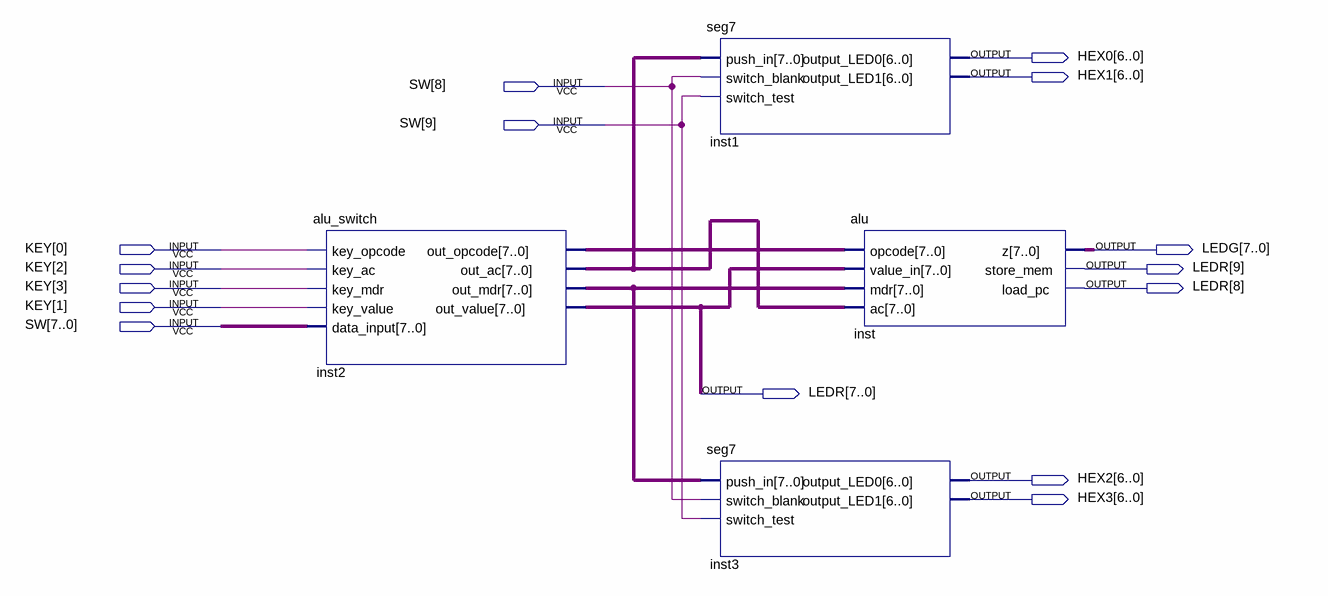
[diagram p0: schematic sheet]
// Quartus schematic alu_sim_tb.bdf as structural Verilog: 4 symbols, 15 pins
module alu_sim_tb (
  input  [9:0] SW,
  input  [3:0] KEY,
  output [6:0] HEX0,
  output [6:0] HEX1,
  output [7:0] LEDG,
  output [9:0] LEDR,
  output [6:0] HEX2,
  output [6:0] HEX3
);

  wire [7:0] inst2_out_ac, inst2_out_mdr, inst2_out_opcode;

  alu_switch inst2 (
    .key_opcode(KEY[0]), .key_ac(KEY[2]), .key_mdr(KEY[3]), .key_value(KEY[1]), .data_input(SW[7:0]),
    .out_opcode(inst2_out_opcode), .out_ac(inst2_out_ac), .out_mdr(inst2_out_mdr), .out_value(LEDR[7:0]));
  seg7 inst1 (
    .push_in(inst2_out_ac), .switch_blank(SW[8]), .switch_test(SW[9]), .output_LED0(HEX0), .output_LED1(HEX1));
  seg7 inst3 (
    .push_in(inst2_out_mdr), .switch_blank(SW[8]), .switch_test(SW[9]), .output_LED0(HEX2), .output_LED1(HEX3));
  alu inst (
    .opcode(inst2_out_opcode), .value_in(LEDR[7:0]), .mdr(inst2_out_mdr), .ac(inst2_out_ac), .z(LEDG),
    .store_mem(LEDR[9]), .load_pc(LEDR[8]));
endmodule
